# EasyEDA Pro project Empel_PCB_Boost_AJ.eprj

# Schematic Schematic1
Board Name: Board1; Create Date: 2025-03-30; Page Name: P1; Project Name: Empel_PCB_Boost_AJ; Schematic Name: Schematic1; Update Date: 2025-03-30; Company: EasyEDA.com; Page Size: A4; Version: V1.0
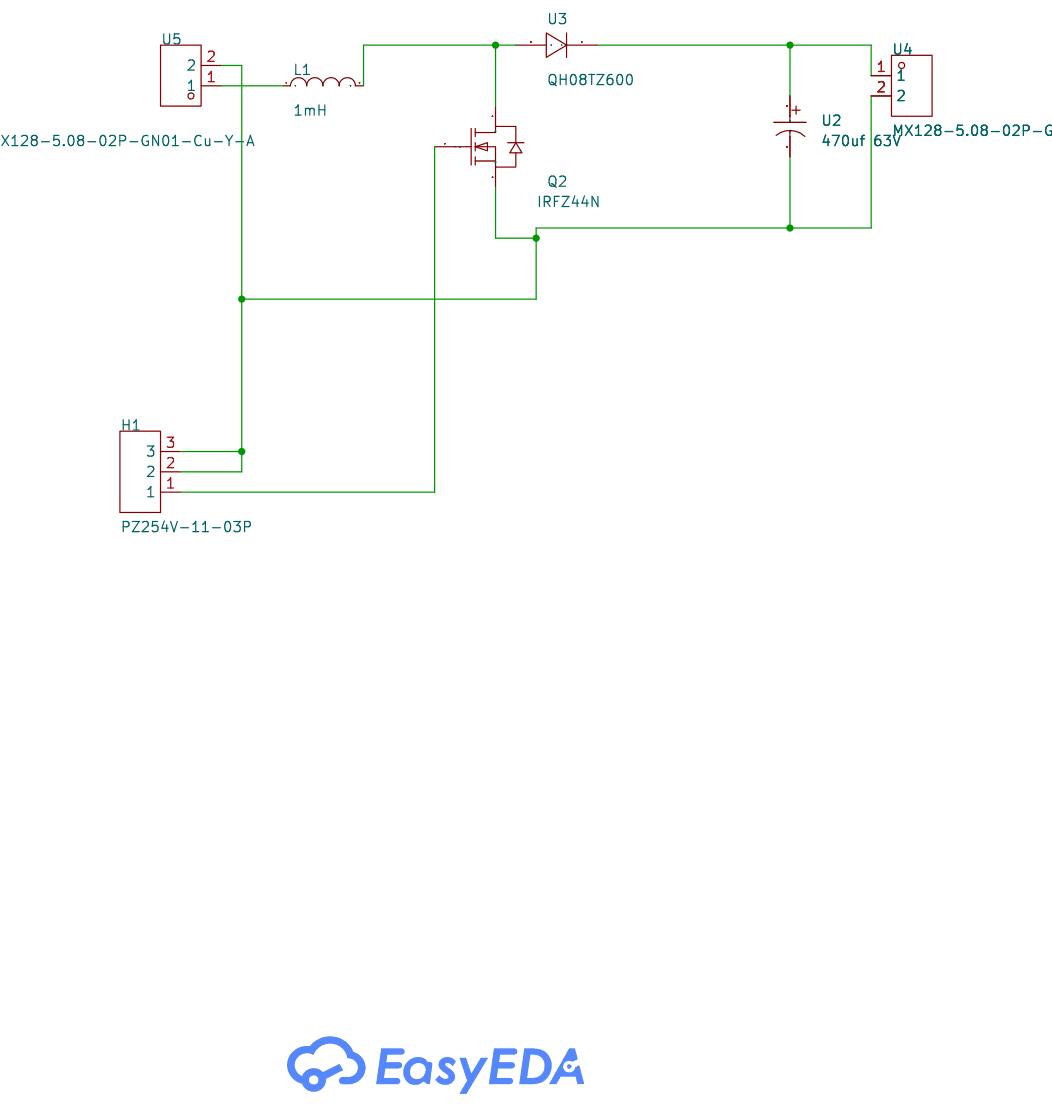
[diagram p0: schematic sheet]

## Parts
H1  PZ254V-11-03P  [HDR-TH_3P-P2.54-V-M]
L1  1mH  [IND-TH_BD32.5-P29.0-D0.7_2324-H-RC]
Q2  IRFZ44N  [TO-220-3_L9.9-W4.5-P2.54-L]
U2  470uf 63V  [CAP-TH_BD12.5-P5.00-D0.6-FD]
U3  QH08TZ600  [TO-220AC_L10.0-W4.5-P5.08-L]
U4  MX128-5.08-02P-GN01-Cu-Y-A  [CONN-TH_2P-P5.08_MX128-5.08-GN01-02P-CU-Y-A]
U5  MX128-5.08-02P-GN01-Cu-Y-A  [CONN-TH_2P-P5.08_MX128-5.08-GN01-02P-CU-Y-A]

## Library data of the parts
H1 = PZ254V-11-03P: LCSC Part Name: 1x3P 间距:2.54mm 方针 直插; Supplier Part: C2937625; Manufacturer: XFCN(兴飞); Supplier Footprint: 插件,P=2.54mm; JLCPCB Part Class: Extended Part; Datasheet: https://atta.szlcsc.com/upload/public/pdf/source/20200309/C492402_8335C3D49C4E4C618838D59BB1D024C1.pdf; Supplier: LCSC; Pin Structure: 1x3P; Pitch: 2.54mm; Circluar Pins/Square Pins: Policy; Mounting Type: Straight; Number of Rows: Single Row; Number of Pins: 3P; Current Rating: 3A; Voltage Rating (Max): 250V; Length of Mating Pin: 6mm; Insulation Height: 2.5mm; Length of End Connection Pin: 3mm; Operating Temperature: -40℃~+105℃; Color: Black
L1 = 2324-H-RC: LCSC Part Name: 1mH ±15%; Supplier Part: C3350085; Manufacturer: BOURNS; Supplier Footprint: 插件,D=32.5mm; JLCPCB Part Class: Extended Part; Datasheet: https://atta.szlcsc.com/upload/public/pdf/source/20210429/1F2405F82C027895AAC6981C0E6D0906.pdf; Supplier: LCSC; Tolerance: ±15%
Q2 = IRFZ44N: LCSC Part Name: 1个N沟道 耐压:60V 电流:60A; Supplier Part: C7429904; Manufacturer: minos(迈诺斯); Supplier Footprint: TO-220; JLCPCB Part Class: Extended Part; Datasheet: https://atta.szlcsc.com/upload/public/pdf/source/20240924/DFAFBF9B70D3F8B82D3192015D71E054.pdf; Supplier: LCSC; Type: 1 N-channel; Drain to Source Voltage: 60V; Current - Continuous Drain(Id): 60A; RDS(on): 12mΩ@10V,25A; Pd - Power Dissipation: 87W; Gate Threshold Voltage (Vgs(th)@Id): 3V; Gate Charge(Qg): 31nC@10V; Input Capacitance(Ciss@Vds): 910pF@25V; Reverse Transfer Capacitance (Crss@Vds): 30pF@25V; Operating Temperature: -55℃~+175℃@(Tj)
U2 = 470uf 63V: Supplier Part: C9900010211; Supplier Footprint: 直径12.5 高度20 5mm 脚距5MM; JLCPCB Part Class: Extended Part; Supplier: LCSC
U3 = QH08TZ600: LCSC Part Name: 电压:600V 电流:8A; Supplier Part: C568356; Manufacturer: Power Integrations(帕沃英蒂格盛); Supplier Footprint: TO-220AC; JLCPCB Part Class: Extended Part; Supplier: LCSC; Forward Voltage (Vf@If): 3.15V@8A; Reverse Voltage (Vr): 600V; Reverse Leakage Current: 250uA@600V; Reverse Recovery Time (trr): 11.1ns
U4 U5 = MX128-5.08-02P-GN01-Cu-Y-A: LCSC Part Name: 1x2P 5.08mm 直插 排数:1 每排P数:2; Supplier Part: C5188467; Manufacturer: MAX(迈旭); Supplier Footprint: 插件,P=5.08mm; JLCPCB Part Class: Extended Part; Datasheet: https://atta.szlcsc.com/upload/public/pdf/source/20230914/C70C2B37C8B738165BCA6D2FE263813D.pdf; Supplier: LCSC; Structure: 1x2P; Pitch: 5.08mm; Color: Green; Mounting Style: Direct Insert; Number of Pins: 2P; Number of Rows: 1; Number of PINs Per Row: 2; Screw Specification: M2.5; Current Rating (Max): 10A; Voltage Rating (Max): 300V; Wire Gauge - AWG: 12~24; Wire Gauge - mm2: 2.5; Operating Temperature Range: -40℃~+105℃

## Nets
$1N789: H1.2 H1.3 Q2.3(S) U2.2 U4.2 U5.2
$1N834: U2.1 U3.1(K) U4.1
$1N946: L1.2 Q2.2(D) U3.2(A)
$1N954: L1.1 U5.1
$1N959: H1.1 Q2.1(G)

# Board PCB1
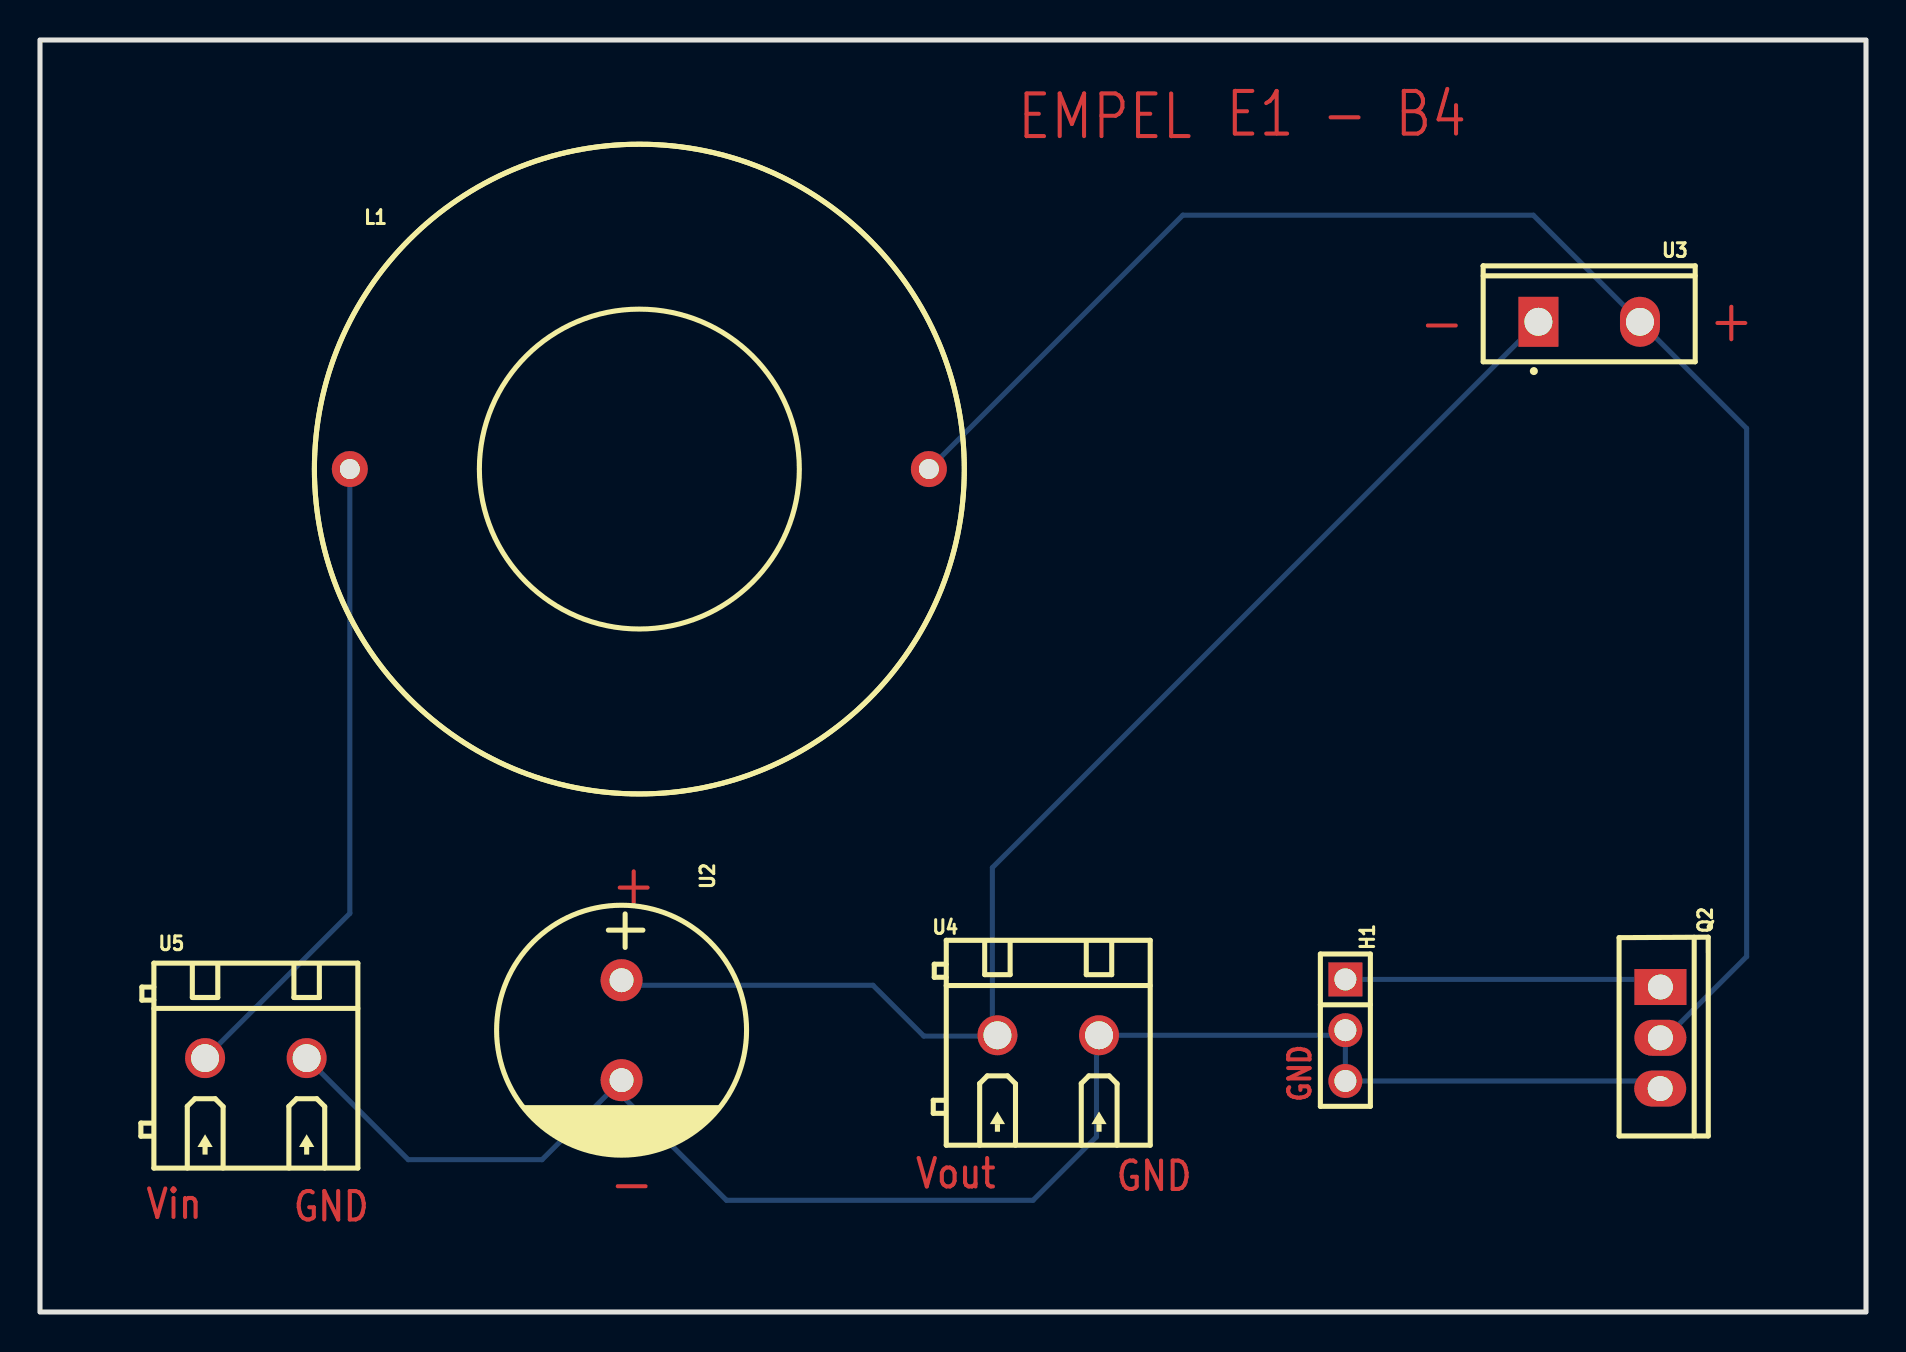
[diagram p1: board, top side]
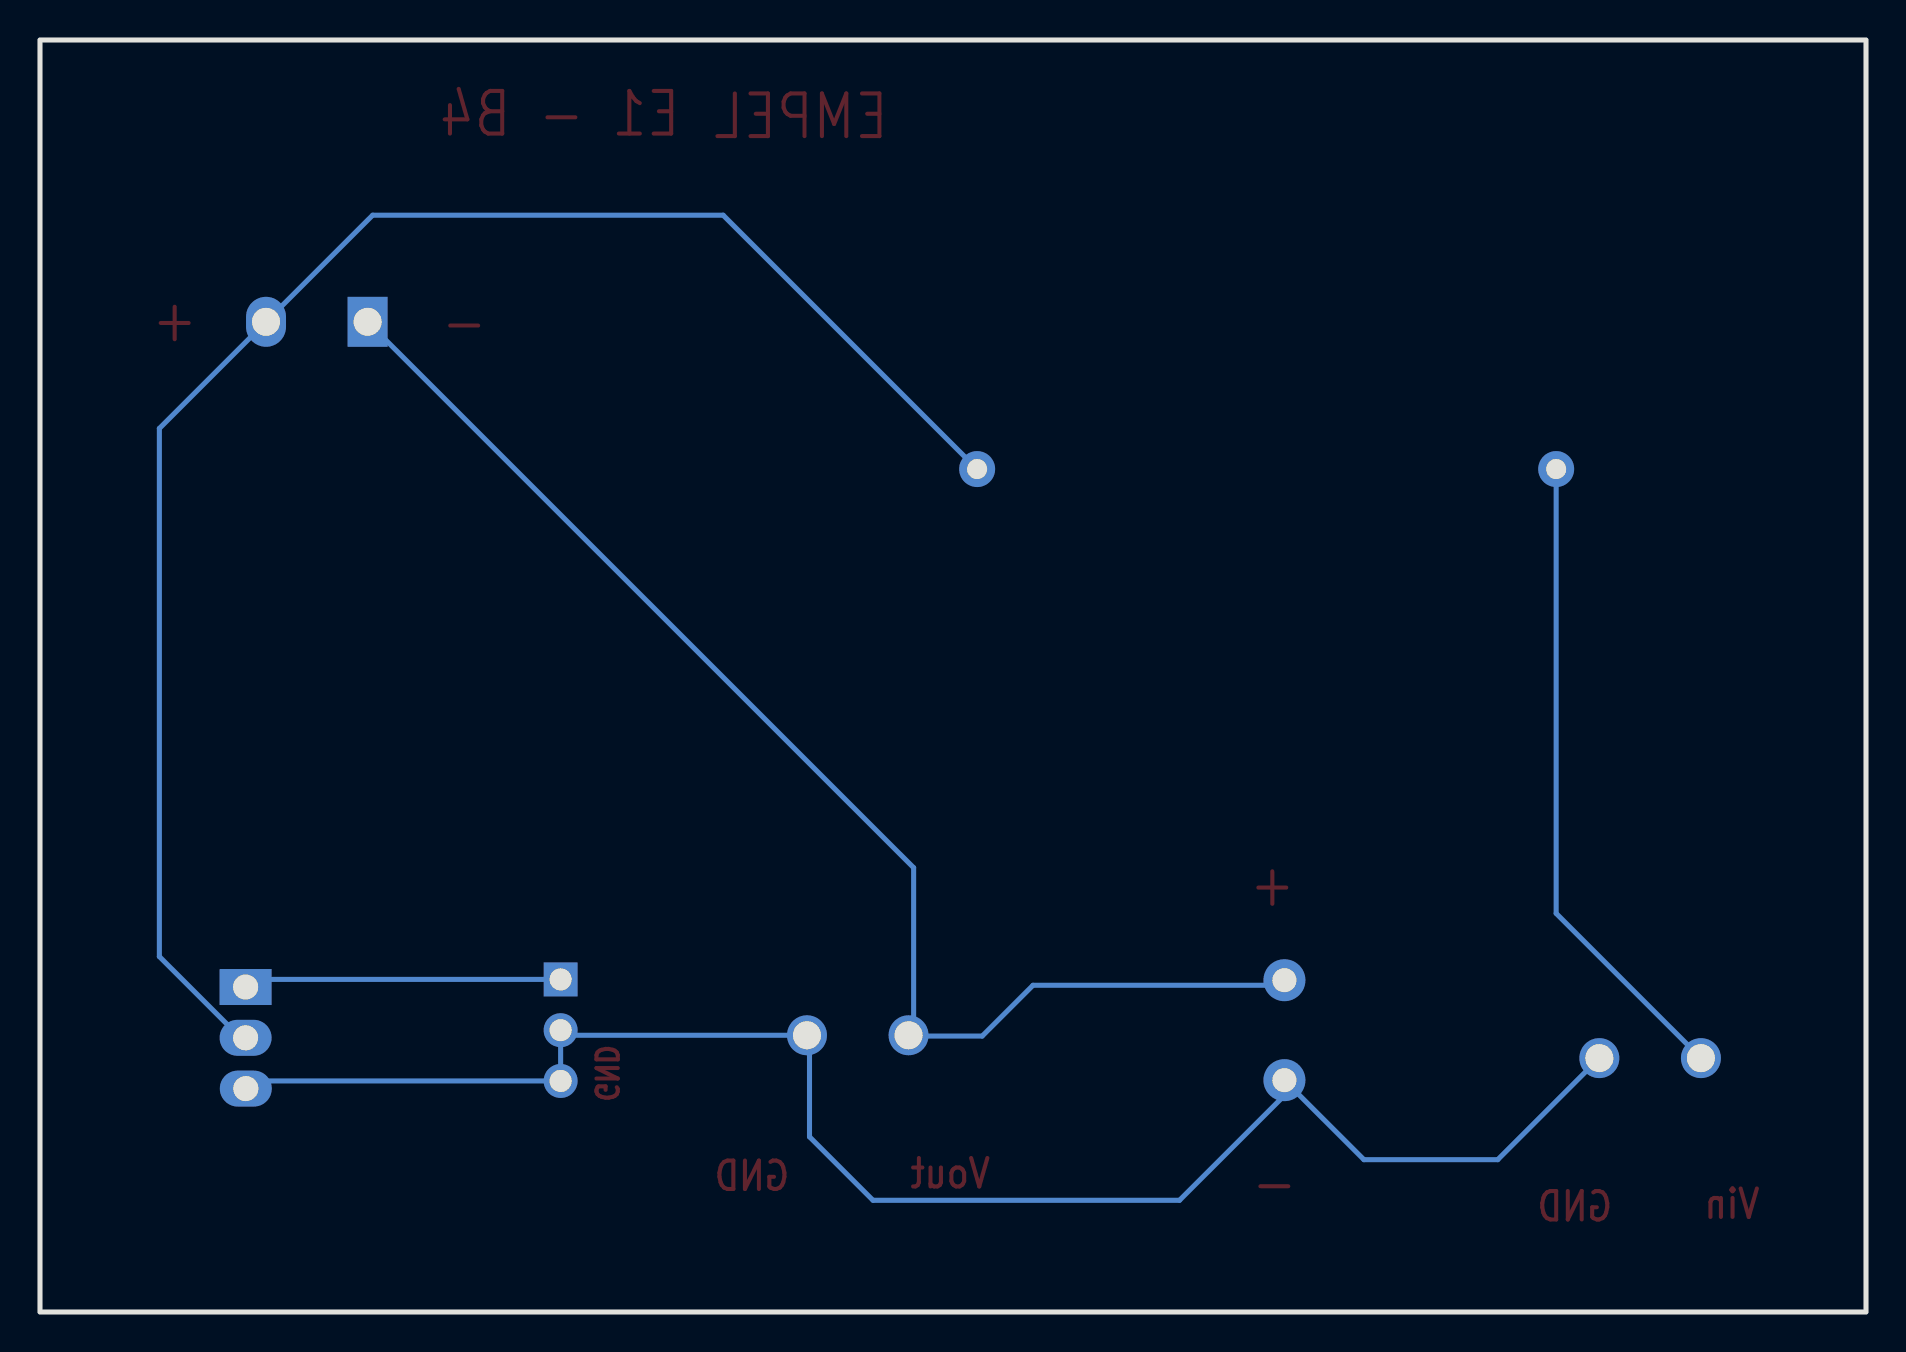
[diagram p2: board, bottom side, seen from below]

Outline 91.31 x 63.63 mm; copper layers: Top Layer, Bottom Layer. Coordinates in mm from the lower left corner of the outline.
Outline path: rectangle 0,63.63 91.31,0
Stack: Top Layer 0.035mm / Dielectric1 1.51mm FR4 er 4.5 / Bottom Layer 0.035mm

## Design rules (mm)
template: JLCPCB Capability(Two Layers Board)
spacing copperThickness1oz (default): track to track 0.102, other pairs 0.152 to 0.3
spacing copperThickness2oz: track to track 0.203, other pairs 0.152 to 0.3
track width copperThickness1oz (default): min 0.127, default 0.254, max 2.54
track width copperThickness2oz: min 0.203, default 0.254, max 2.54
differential pair differentialPair (default): width min 0.127, default 0.254, max 2.54; gap min 0.152, default 0.152
via viaSize (default): diameter min 0.5, default 0.61, max 10; hole min 0.3, default 0.305, max 6.3

## Placement (name value [footprint] x y rotation side)
H1  PZ254V-11-03P  [HDR-TH_3P-P2.54-V-M]  65.28 14.1 270 top
L1  1mH  [IND-TH_BD32.5-P29.0-D0.7_2324-H-RC]  29.97 42.16 0 top
Q2  IRFZ44N  [TO-220-3_L9.9-W4.5-P2.54-L]  81.03 13.72 270 top
U2  470uf 63V  [CAP-TH_BD12.5-P5.00-D0.6-FD]  29.08 14.1 270 top
U3  QH08TZ600  [TO-220AC_L10.0-W4.5-P5.08-L]  77.47 49.53 0 top
U4  MX128-5.08-02P-GN01-Cu-Y-A  [CONN-TH_2P-P5.08_MX128-5.08-GN01-02P-CU-Y-A]  50.42 13.84 0 top
U5  MX128-5.08-02P-GN01-Cu-Y-A  [CONN-TH_2P-P5.08_MX128-5.08-GN01-02P-CU-Y-A]  10.8 12.7 0 top

## Footprints (pads in the part's own frame, mm; a bottom-side part is the same pattern mirrored in y, then rotated)
CAP-TH_BD12.5-P5.00-D0.6-FD
  round 2.1 hole 1.2: 1(-2.5,0) 2(2.5,0)
CONN-TH_2P-P5.08_MX128-5.08-GN01-02P-CU-Y-A
  round 2 hole 1.4: 1(-2.54,0) 2(2.54,0)
HDR-TH_3P-P2.54-V-M
  rect 1.7x1.7 hole 1.1: 1(-2.54,0)
  round 1.7 hole 1.1: 2(0,0) 3(2.54,0)
IND-TH_BD32.5-P29.0-D0.7_2324-H-RC
  round 1.8 hole 1: 1(-14.478,0) 2(14.478,0)
TO-220-3_L9.9-W4.5-P2.54-L
  rect 1.8x2.6 hole 1.25: 1(-2.54,0.005)
  oval 1.8x2.6 hole 1.25: 2(0,0.005) 3(2.54,-0.005)
TO-220AC_L10.0-W4.5-P5.08-L
  rect 2x2.5 hole 1.4: 1(-2.54,0)
  oval 2x2.5 hole 1.4: 2(2.54,0)

## Nets
As in the schematic.

## Routing (per net, layer and track width the routed paths; a pad name or vN(x,y) marks a point on that pad's centre or on a via; arc(x,y) is an arc through that point)
$1N789: length 83.4
  Bottom Layer w0.254: Q2.3 80.64,11.56 H1.3 65.28,13.84 ; 65.28,13.84 U4.2 52.83,13.72 52.83,8.76 49.66,5.59 34.33,5.59 29.08,10.83 U2.2 25.11,7.62 18.42,7.62 U5.2 ; 65.28,13.84 H1.2
$1N834: length 66.9
  Bottom Layer w0.254: 47.63,14.06 47.37,13.8 44.2,13.8 41.66,16.34 29.34,16.34 U2.1 ; 47.63,14.06 47.63,22.22 74.93,49.53 ; 47.63,14.06 U4.1
$1N946: length 83
  Bottom Layer w0.254: Q2.2 81.28,13.72 85.34,17.78 85.34,44.2 U3.2 74.68,54.86 57.15,54.86 L1.2
$1N954: length 32.5
  Bottom Layer w0.254: L1.1 15.49,19.94 U5.1
$1N959: length 15.9
  Bottom Layer w0.254: Q2.1 80.65,16.64 65.28,16.64

## Text on the board
Top Layer: GND | Vin | Vout | - | + | EMPEL | E1 - B4
